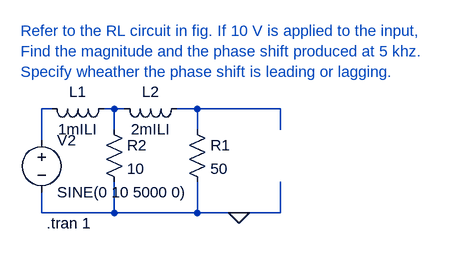
[diagram p0: schematic Lab5_ques4.asc]
Lab5_ques4.asc, the LTspice schematic file:
Version 4
SHEET 1 880 680
WIRE 16 192 0 192
WIRE 112 192 96 192
WIRE 128 192 112 192
WIRE 240 192 208 192
WIRE 368 192 240 192
WIRE 112 224 112 192
WIRE 240 224 240 192
WIRE 368 224 368 192
WIRE 0 240 0 192
WIRE 0 352 0 320
WIRE 112 352 112 304
WIRE 112 352 0 352
WIRE 240 352 240 304
WIRE 240 352 112 352
WIRE 304 352 240 352
WIRE 368 352 368 304
WIRE 368 352 304 352
FLAG 304 352 0
SYMBOL Res 224 208 R0
SYMATTR InstName R1
SYMATTR Value 50
SYMBOL Res 96 208 R0
SYMATTR InstName R2
SYMATTR Value 10
SYMBOL Ind 112 176 R90
WINDOW 0 5 56 VBottom 2
WINDOW 3 32 56 VTop 2
SYMATTR InstName L1
SYMATTR Value 1mILI
SYMBOL Ind 224 176 R90
WINDOW 0 5 56 VBottom 2
WINDOW 3 32 56 VTop 2
SYMATTR InstName L2
SYMATTR Value 2mILI
SYMBOL Voltage 0 224 R0
SYMATTR InstName V2
SYMATTR Value SINE(0 10 5000 0)
TEXT -32 72 Left 2 ;Refer to the RL circuit in fig. If 10 V is applied to the input, \nFind the magnitude and the phase shift produced at 5 khz. \nSpecify wheather the phase shift is leading or lagging.
TEXT 8 368 Left 2 !.tran 1

The netlist it stands for:
* Lab5_ques4.asc
R1 N003 0 50
R2 N002 0 10
L1 N002 N001 1mILI
L2 N003 N002 2mILI
V2 N001 0 SINE(0 10 5000 0)
* Refer to the RL circuit in fig. If 10 V is applied to the input,
* Find the magnitude and the phase shift produced at 5 khz.
* Specify wheather the phase shift is leading or lagging.
.tran 1
.backanno
.end